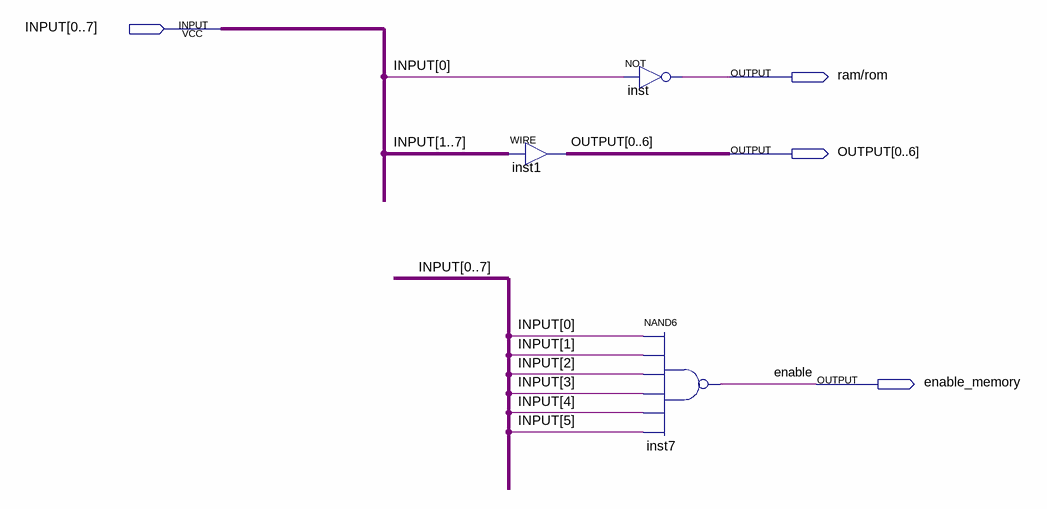
[diagram p0: schematic sheet]
// Quartus schematic ROM_RAM_MAPPER.bdf as structural Verilog: 3 symbols, 4 pins
module ROM_RAM_MAPPER (
  input  [0:7] INPUT,
  output \ram/rom ,
  output [0:6] OUTPUT,
  output enable_memory
);

  assign OUTPUT = INPUT[1:7];  // WIRE inst1
  not inst (\ram/rom , INPUT[0]);
  nand inst7 (enable_memory, INPUT[0], INPUT[1], INPUT[2], INPUT[3], INPUT[4], INPUT[5]);

  // Other names for the same wires on the sheet: enable = enable_memory
endmodule
